# EAGLE design CAT-control-V1 (EAGLE 9.2.2)
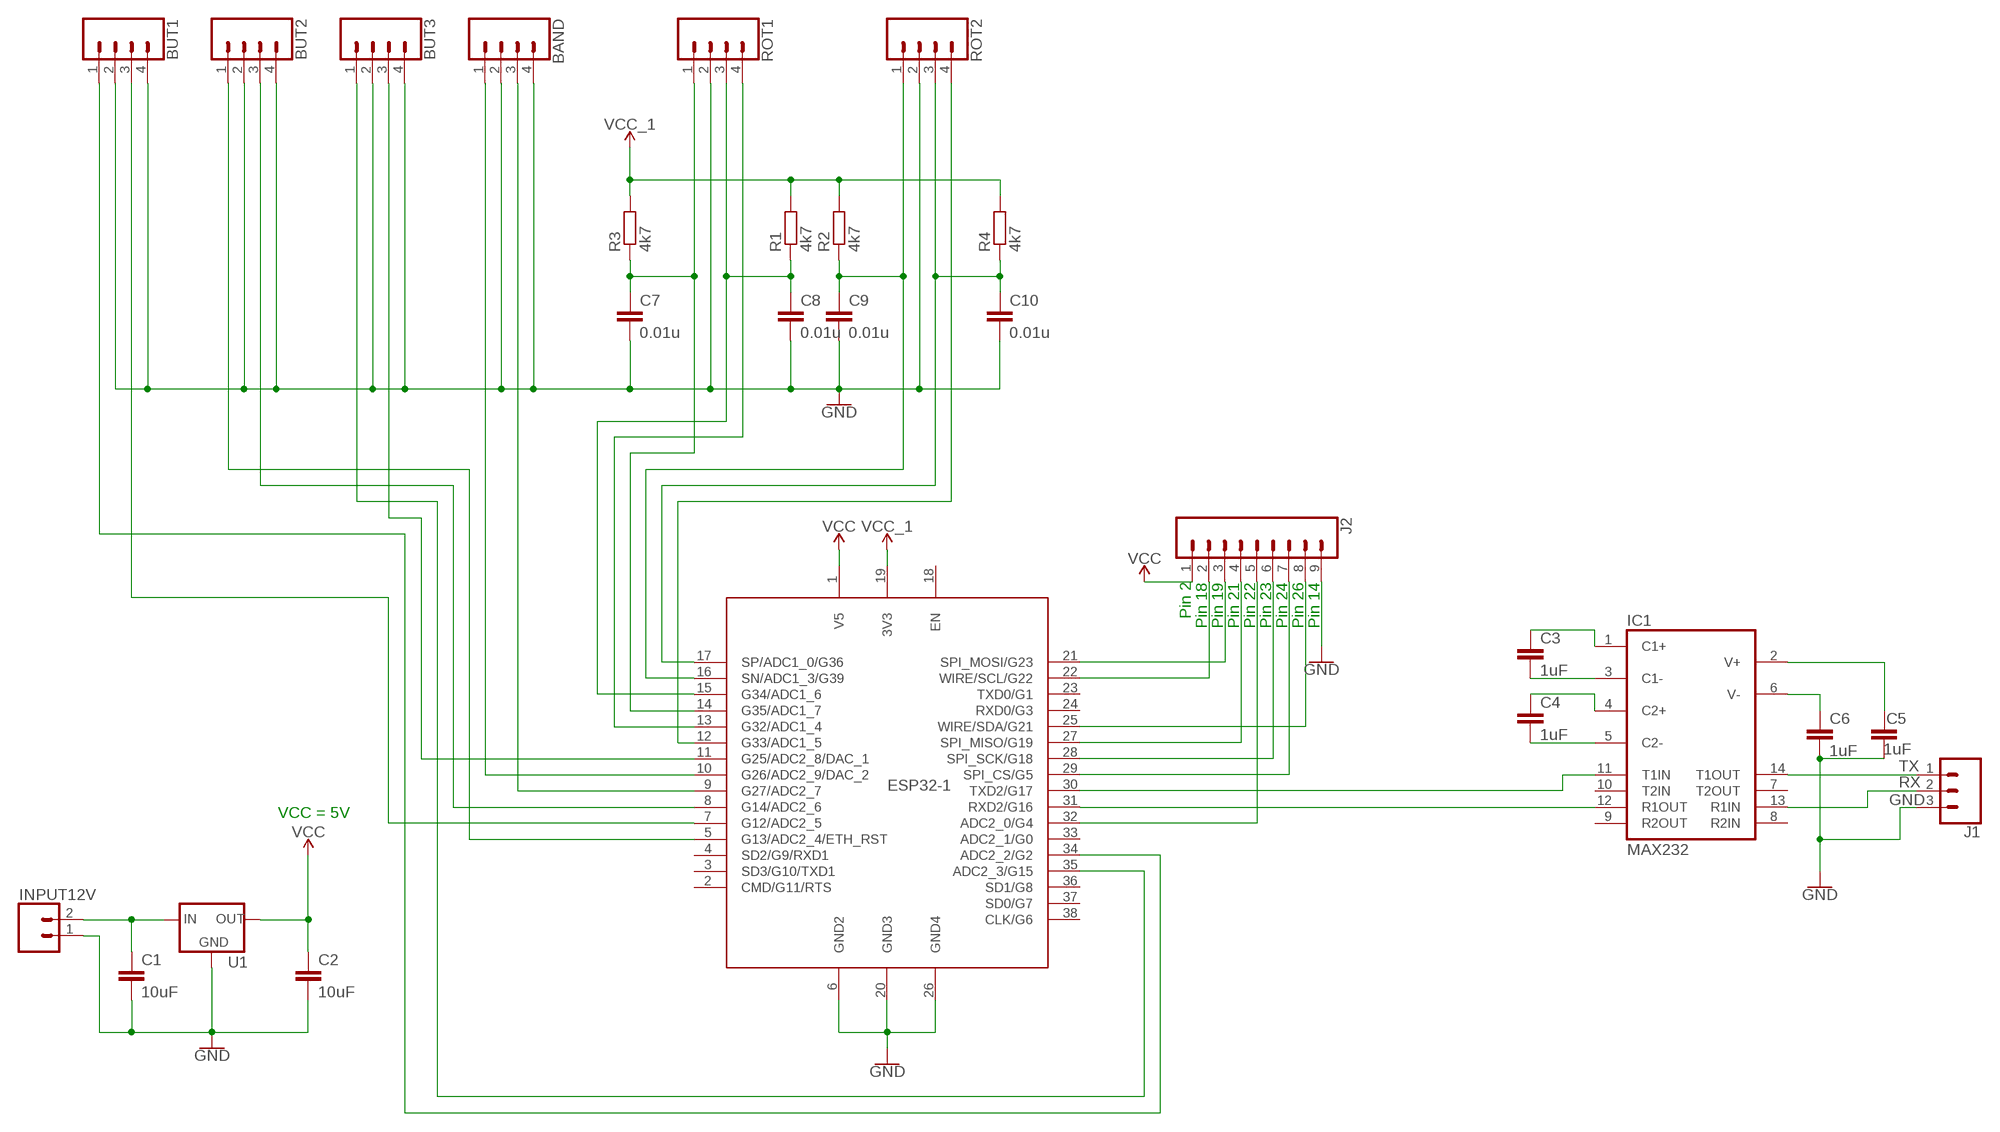
[diagram p0: schematic, sheet 1]

## Parts
BAND  CONN_04POLAR  [MOLEX-1X4]
BUT1  CONN_04POLAR  [MOLEX-1X4]
BUT2  CONN_04POLAR  [MOLEX-1X4]
BUT3  CONN_04POLAR  [MOLEX-1X4]
C1  10uF  CAPACITORS-EUC1206  [C1206]
C2  10uF  CAPACITORS-EUC1206  [C1206]
C3  1uF  CAPACITORS-EUC1206  [C1206]
C4  1uF  CAPACITORS-EUC1206  [C1206]
C5  1uF  CAPACITORS-EUC1206  [C1206]
C6  1uF  CAPACITORS-EUC1206  [C1206]
C7  0.01u  CAPACITORS-EU025-024X044  [C025-024X044]
C8  0.01u  CAPACITORS-EU025-024X044  [C025-024X044]
C9  0.01u  CAPACITORS-EU025-024X044  [C025-024X044]
C10  0.01u  CAPACITORS-EU025-024X044  [C025-024X044]
ESP32-1  NODEMCU_ESP32_WROOM_32  [NODEMCU_ESP32_WROOM_32--38PINS]
IC1  MAX232  [DIL16]
INPUT12V  CONN_025MM  [SCREWTERMINAL-5MM-2]
J1  CONN_03SCREW  [SCREWTERMINAL-3.5MM-3]
J2  CONN_09  [1X09]
R1  4k7  RESISTORS-EUR1206  [R1206]
R2  4k7  RESISTORS-EUR1206  [R1206]
R3  4k7  RESISTORS-EUR1206  [R1206]
R4  4k7  RESISTORS-EUR1206  [R1206]
ROT1  CONN_04POLAR  [MOLEX-1X4]
ROT2  CONN_04POLAR  [MOLEX-1X4]
U1  V_REG_78XXSINK  [TO220-IGO]

## Nets
GND: BAND.2 BAND.4 BUT1.2 BUT1.4 BUT2.2 BUT2.4 BUT3.2 BUT3.4 C1.2 C2.2 C5.1 C6.2 C7.2 C8.2 C9.2 C10.2 ESP32-1.6(GND2) ESP32-1.20(GND3) ESP32-1.26(GND4) INPUT12V.1 J1.3 J2.9 ROT1.2 ROT2.2 U1.GND
N$1: C1.1 INPUT12V.2 U1.IN
N$2: C3.1 IC1.1(C1+)
N$3: C3.2 IC1.3(C1-)
N$4: C4.1 IC1.4(C2+)
N$5: C4.2 IC1.5(C2-)
N$6: C8.1 ESP32-1.15(G34/ADC1_6) R1.1 ROT1.3
N$7: C6.1 IC1.6(V-)
N$8: C5.2 IC1.2(V+)
N$9: ESP32-1.31(RXD2/G16) IC1.12(R1OUT)
N$10: ESP32-1.22(WIRE/SCL/G22) J2.2
N$11: ESP32-1.21(SPI_MOSI/G23) J2.3
N$12: ESP32-1.32(ADC2_0/G4) J2.5
N$13: ESP32-1.27(SPI_MISO/G19) J2.4
N$14: ESP32-1.29(SPI_CS/G5) J2.7
N$15: ESP32-1.28(SPI_SCK/G18) J2.6
N$16: ESP32-1.25(WIRE/SDA/G21) J2.8
N$17: ESP32-1.13(G32/ADC1_4) ROT1.4
N$18: C10.1 ESP32-1.17(SP/ADC1_0/G36) R4.1 ROT2.3
N$19: C9.1 ESP32-1.16(SN/ADC1_3/G39) R2.1 ROT2.1
N$20: ESP32-1.30(TXD2/G17) IC1.11(T1IN)
N$21: BAND.1 ESP32-1.10(G26/ADC2_9/DAC_2)
N$22: ESP32-1.12(G33/ADC1_5) ROT2.4
N$23: C7.1 ESP32-1.14(G35/ADC1_7) R3.1 ROT1.1
N$24: BAND.3 ESP32-1.9(G27/ADC2_7)
N$25: BUT2.1 ESP32-1.5(G13/ADC2_4/ETH_RST)
N$26: BUT1.3 ESP32-1.7(G12/ADC2_5)
N$27: BUT3.1 ESP32-1.35(ADC2_3/G15)
N$28: BUT3.3 ESP32-1.11(G25/ADC2_8/DAC_1)
N$29: BUT1.1 ESP32-1.34(ADC2_2/G2)
N$31: BUT2.3 ESP32-1.8(G14/ADC2_6)
RX: IC1.13(R1IN) J1.2
TX: IC1.14(T1OUT) J1.1
VCC: C2.1 ESP32-1.1(V5) J2.1 U1.OUT
VCC_1: ESP32-1.19(3V3) R1.2 R2.2 R3.2 R4.2
Unconnected: ESP32-1.3(SD3/G10/TXD1) ESP32-1.4(SD2/G9/RXD1) ESP32-1.18(EN) ESP32-1.23(TXD0/G1) ESP32-1.24(RXD0/G3) ESP32-1.33(ADC2_1/G0) ESP32-1.36(SD1/G8) ESP32-1.37(SD0/G7) ESP32-1.38(CLK/G6) IC1.7(T2OUT) IC1.8(R2IN) IC1.9(R2OUT) IC1.10(T2IN)

## Notes on the sheet
- Pin 2
- Pin 18 | Pin 19 | Pin 21 | Pin 22 | Pin 23 | Pin 24 | Pin 26 | Pin 14
- VCC = 5V

## Power pins joined to a net without a drawn wire
CMD/G11/RTS: ESP32-1.2(CMD/G11/RTS)
GND: IC1.15(GND)
VCC: IC1.16(VCC)

## Library data of the parts
BAND BUT1-BUT3 ROT1 ROT2 = Matejevi_elementi:CONN_04: Multi connection point. Often used as Generic Header-pin footprint for 0.1 inch spaced/style header connections On any of the 0.1 inch spaced packages, you can populate with these: Break Away Headers - Straight <https://www.sparkfun.com/products/116> (PRT-00116) Break Away Male Headers - Right Angle <https://www.sparkfun.com/products/553> (PRT-00553) Female Headers <https://www.sparkfun.com/products/115> (PRT-00115) Break Away Headers - Machine Pin <https://www.sparkfun.com/products/117> (PRT-00117) Break Away Female Headers - Swiss Machine Pin <https://www.sparkfun.com/products/743> (PRT-00743) For SCREWTERMINALS and SPRING TERMINALS visit here: Screw Terimnals on SparkFun.com <https://www.sparkfun.com/search/results?term=Screw+Terminals> (5mm/3.5mm/2.54mm spacing) This device is also useful as a general connection point to wire up your design to another part of your project. Our various solder wires solder well into these plated through hole pads. Hook-Up Wire - Assortment (Stranded, 22 AWG) <https://www.sparkfun.com/products/11375> (PRT-11375) Hook-Up Wire - Assortment (Solid Core, 22 AWG) <https://www.sparkfun.com/products/11367> (PRT-11367) View the entire wire category on our website here <https://www.sparkfun.com/categories/141> Special notes: Molex polarized connector foot print use with SKU : PRT-08231 with associated crimp pins and housings. 1MM SMD Version SKU: PRT-10208; PROD_ID: CONN-08186; SF_ID: PRT-08231
C1-C10 = Matejevi_elementi:CAPACITORS-EU: CAPACITOR, European symbol; SPICEPREFIX: C
ESP32-1 = ESP32_NODEMCU_WROOM_32:NODEMCU_ESP32_WROOM_32: NODEMCU ESP32 WROOM 32 38 Pins PINOUT: https://cdn.shopify.com/s/files/1/1509/1638/files/ESP_-_32_NodeMCU_Developmentboard_Pinout_Diagram.jpg?4479111012146266271; ESP: ESP32 WROOM 32
IC1 = maxim:MAX232: RS232 TRANSCEIVER; MF: MAXIM; MPN: MAX232ACPE+; OC_FARNELL: 9723773; OC_NEWARK: 68K4544
INPUT12V = Matejevi_elementi:CONN_02: Multi connection point. Often used as Generic Header-pin footprint for 0.1 inch spaced/style header connections On any of the 0.1 inch spaced packages, you can populate with these: Break Away Headers - Straight <https://www.sparkfun.com/products/116> (PRT-00116) Break Away Male Headers - Right Angle <https://www.sparkfun.com/products/553> (PRT-00553) Female Headers <https://www.sparkfun.com/products/115> (PRT-00115) Break Away Headers - Machine Pin <https://www.sparkfun.com/products/117> (PRT-00117) Break Away Female Headers - Swiss Machine Pin <https://www.sparkfun.com/products/743> (PRT-00743) For SCREWTERMINALS and SPRING TERMINALS visit here: Screw Terimnals on SparkFun.com <https://www.sparkfun.com/search/results?term=Screw+Terminals> (5mm/3.5mm/2.54mm spacing) This device is also useful as a general connection point to wire up your design to another part of your project. Our various solder wires solder well into these plated through hole pads. Hook-Up Wire - Assortment (Stranded, 22 AWG) <https://www.sparkfun.com/products/11375> (PRT-11375) Hook-Up Wire - Assortment (Solid Core, 22 AWG) <https://www.sparkfun.com/products/11367> (PRT-11367) View the entire wire category on our website here <https://www.sparkfun.com/categories/141> Special notes: Molex polarized connector foot print use with: PRT-08233 with associated crimp pins and housings. 2.54_SCREWTERM for use with PRT-10571. 3.5mm Screw Terminal footprints for PRT-08084 5mm Screw Terminal footprints for use with PRT-08432; SF_SKU: PRT-08432
J1 = Matejevi_elementi:CONN_03: Multi connection point. Often used as Generic Header-pin footprint for 0.1 inch spaced/style header connections On any of the 0.1 inch spaced packages, you can populate with these: Break Away Headers - Straight <https://www.sparkfun.com/products/116> (PRT-00116) Break Away Male Headers - Right Angle <https://www.sparkfun.com/products/553> (PRT-00553) Female Headers <https://www.sparkfun.com/products/115> (PRT-00115) Break Away Headers - Machine Pin <https://www.sparkfun.com/products/117> (PRT-00117) Break Away Female Headers - Swiss Machine Pin <https://www.sparkfun.com/products/743> (PRT-00743) Stackable Header - 3 Pin (Female, 0.1") <https://www.sparkfun.com/products/13875> (PRT-13875) For SCREWTERMINALS and SPRING TERMINALS visit here: Screw Terimnals on SparkFun.com <https://www.sparkfun.com/search/results?term=Screw+Terminals> (5mm/3.5mm/2.54mm spacing) This device is also useful as a general connection point to wire up your design to another part of your project. Our various solder wires solder well into these plated through hole pads. Hook-Up Wire - Assortment (Stranded, 22 AWG) <https://www.sparkfun.com/products/11375> (PRT-11375) Hook-Up Wire - Assortment (Solid Core, 22 AWG) <https://www.sparkfun.com/products/11367> (PRT-11367) View the entire wire category on our website here <https://www.sparkfun.com/categories/141> Special notes: Molex polarized connector foot print use with SKU : PRT-08232 with associated crimp pins and housings.; PROD_ID: CONN-08288; SF_ID: PRT-08235
J2 = SparkFun-Connectors:CONN_09: Multi connection point. Often used as Generic Header-pin footprint for 0.1 inch spaced/style header connections On any of the 0.1 inch spaced packages, you can populate with these: Break Away Headers - Straight <https://www.sparkfun.com/products/116> (PRT-00116) Break Away Male Headers - Right Angle <https://www.sparkfun.com/products/553> (PRT-00553) Female Headers <https://www.sparkfun.com/products/115> (PRT-00115) Break Away Headers - Machine Pin <https://www.sparkfun.com/products/117> (PRT-00117) Break Away Female Headers - Swiss Machine Pin <https://www.sparkfun.com/products/743> (PRT-00743) For SCREWTERMINALS and SPRING TERMINALS visit here: Screw Terimnals on SparkFun.com <https://www.sparkfun.com/search/results?term=Screw+Terminals> (5mm/3.5mm/2.54mm spacing) This device is also useful as a general connection point to wire up your design to another part of your project. Our various solder wires solder well into these plated through hole pads. Hook-Up Wire - Assortment (Stranded, 22 AWG) <https://www.sparkfun.com/products/11375> (PRT-11375) Hook-Up Wire - Assortment (Solid Core, 22 AWG) <https://www.sparkfun.com/products/11367> (PRT-11367) View the entire wire category on our website here <https://www.sparkfun.com/categories/141> Special notes: Molex polarized connector foot print use with SKU : PRT-08231 with associated crimp pins and housings. 1MM SMD Version SKU: PRT-10208 NOTES ON THE VARIANTS LOCK and LOCK_LONGPADS... This footprint was designed to help hold the alignment of a through-hole component (i.e. 6-pin header) while soldering it into place. You may notice that each hole has been shifted either up or down by 0.005 of an inch from it's more standard position (which is a perfectly straight line). This slight alteration caused the pins (the squares in the middle) to touch the edges of the holes. Because they are alternating, it causes a "brace" to hold the component in place. 0.005 has proven to be the perfect amount of "off-center" position when using our standard breakaway headers. Although looks a little odd when you look at the bare footprint, once you have a header in there, the alteration is very hard to notice. Also,if you push a header all the way into place, it is covered up entirely on the bottom side.
R1-R4 = Matejevi_elementi:RESISTORS-EU: RESISTOR, European symbol; SPICEPREFIX: R
U1 = Matejevi_elementi:V_REG_78XX: Voltage Regulator Standard 78xx regulator. IGO (Input Ground Output). Spark Fun Electronics SKU : COM-00107

## Board
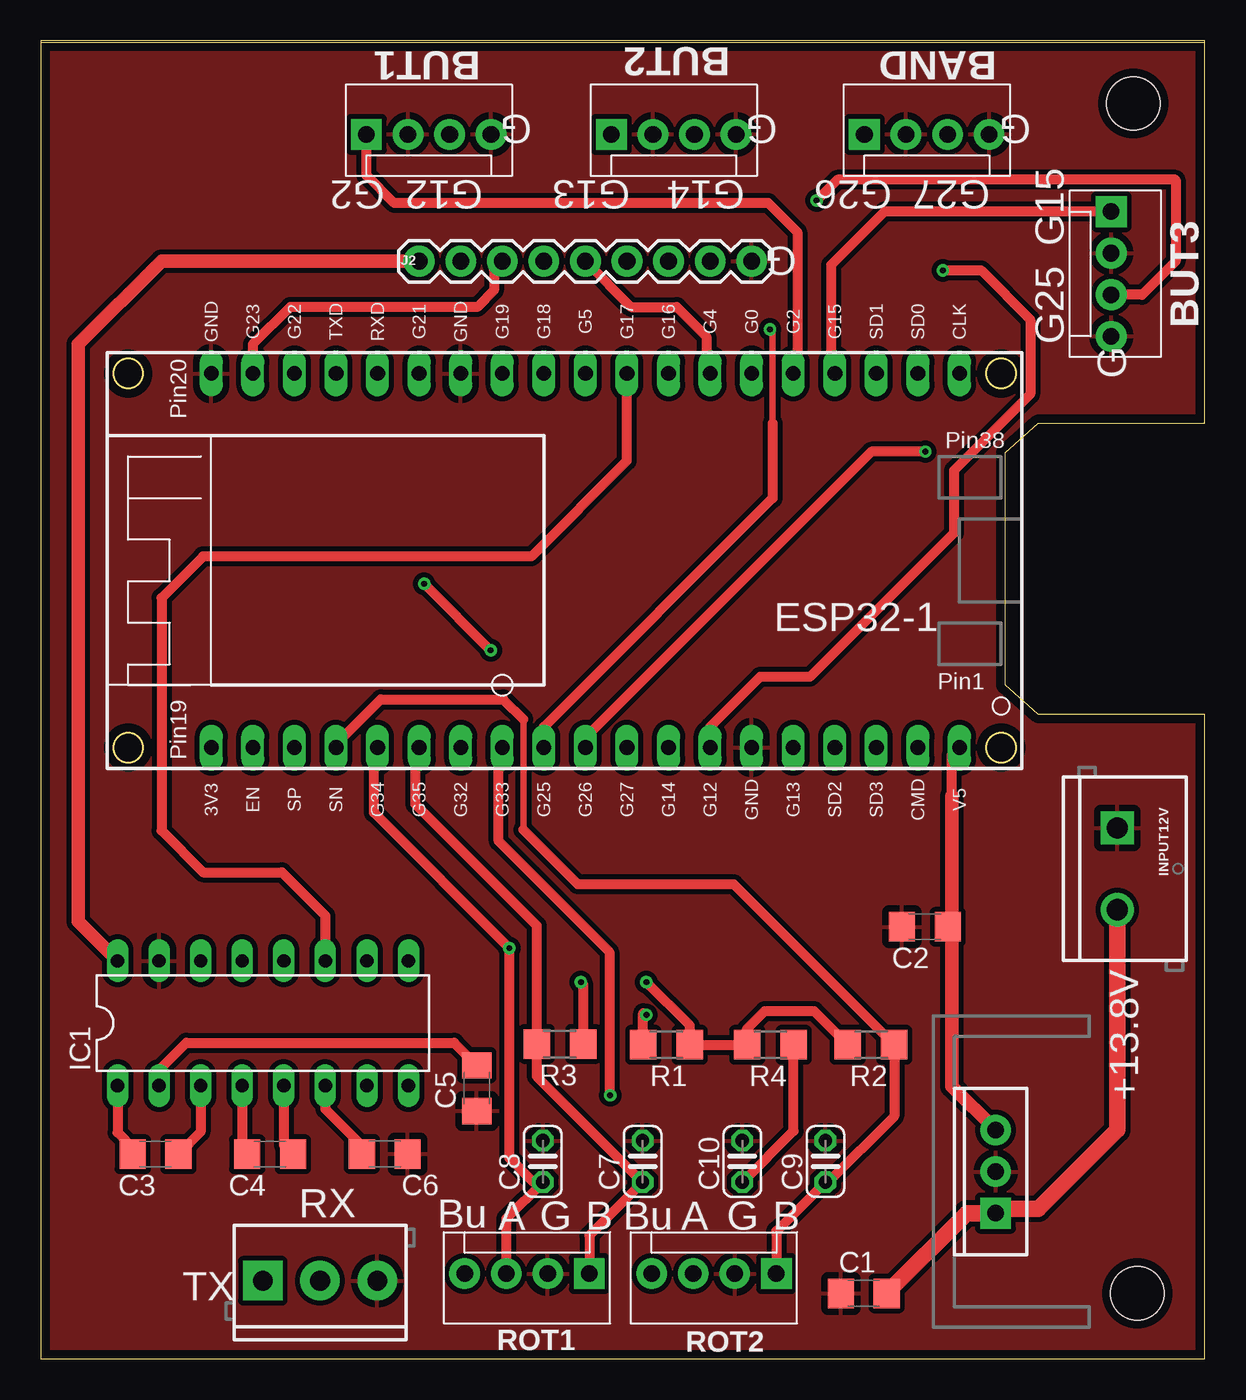
[diagram p1: board, top side]
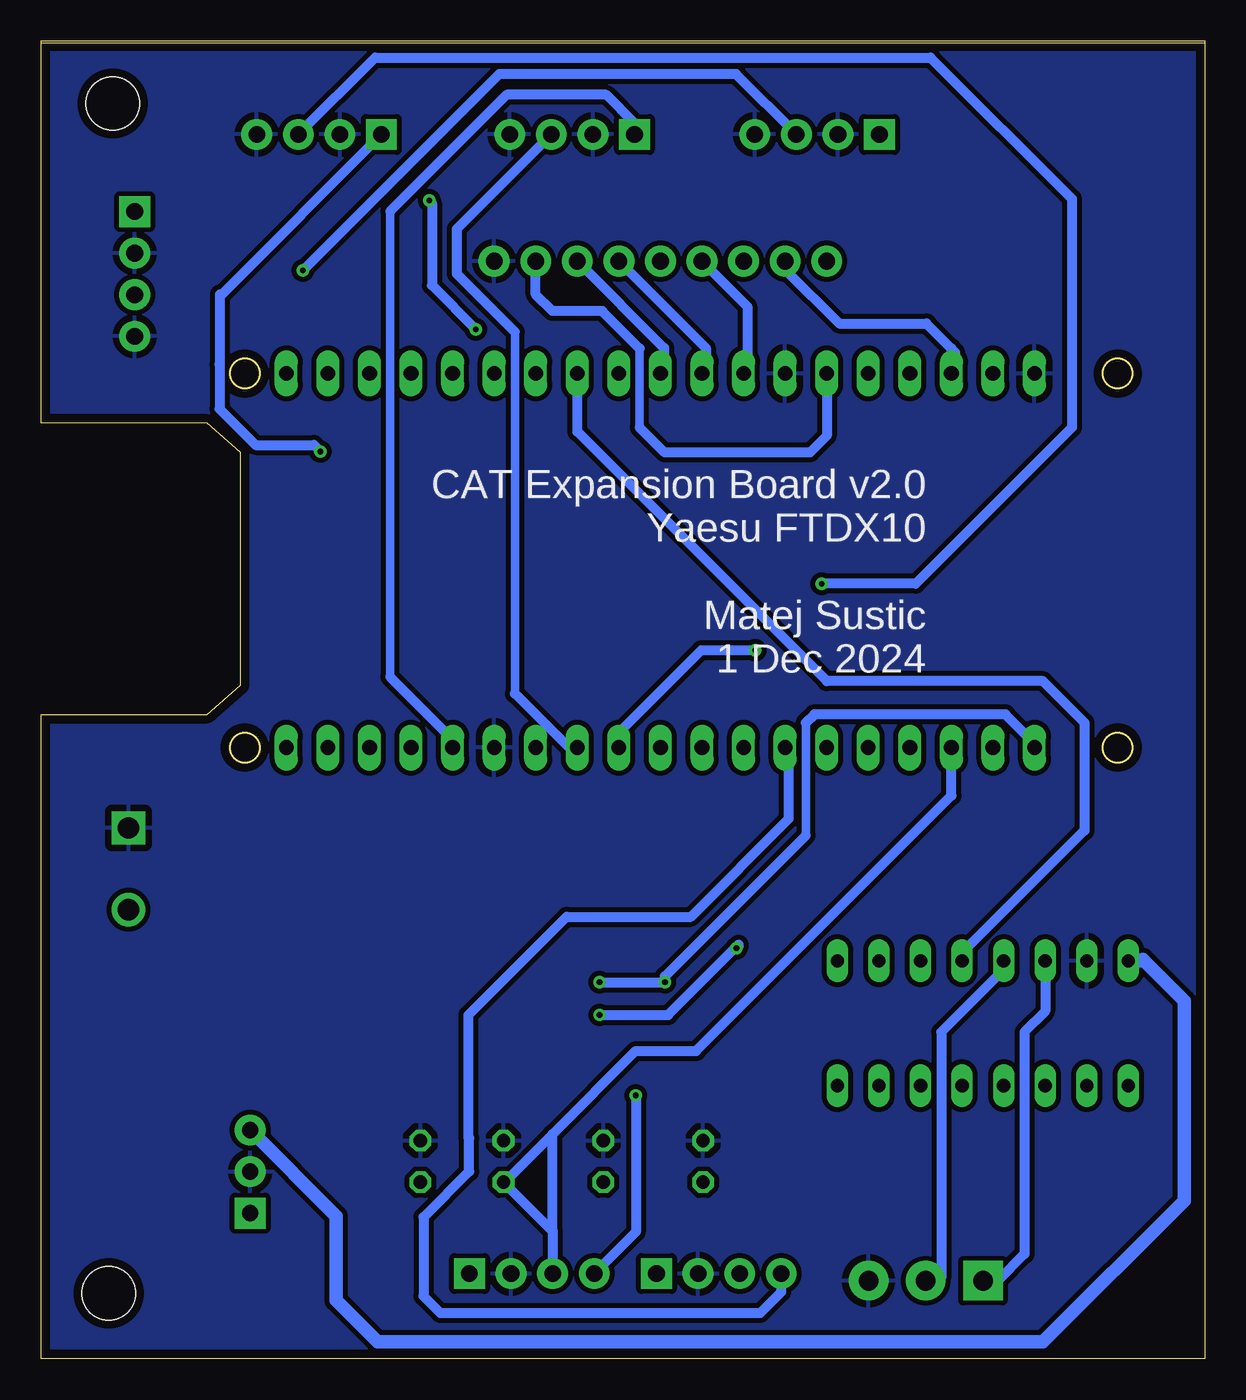
[diagram p2: board, bottom side, seen from below]

Size 71.13 x 80.52 mm. Coordinates in mm from the lower left corner, seen from the top.
Outline: 0,0 71.11,0
Outline: 71.13,80.39 0,80.39 0,0
Outline: 0,0 71.12,0 71.12,39.37 60.96,39.37 58.93,41.15 58.93,55.37 60.96,57.15 71.12,57.15 71.12,80.52 0,80.52 0,0
Copper layers (1*16): Top 0.035mm / dielectric 1.5mm / Bottom 0.035mm
Design rules "default *": minimum track width 16mil, minimum drill 0.35mm, track to track 12mil, track to pad 12mil, pad to pad 12mil, via to via 12mil, smd to smd 12mil, copper to edge 20mil, drill to drill 10mil, minimum pad ring 10mil, minimum via ring 8mil, stop-mask expansion 4mil, vias tented up to drill 0mil, thermal gap 16mil
Holes 3.25 mm at 66.75,76.7 67,4

### Footprints (pad centres in the part's own frame; a part is rotated, then mirrored left to right if it is on the bottom)
MOLEX-1X4 = drill 1.016 pad 1.88 square: 1 0,0 | drill 1.016 pad 1.88: 2 2.54,0; 3 5.08,0; 4 7.62,0
C1206 = smd 1.6 x 1.8: 1 -1.4,0; 2 1.4,0
C025-024X044 = drill 0.813 octagon: 1 -1.27,0; 2 1.27,0
NODEMCU_ESP32_WROOM_32--38PINS = drill 0.9 long: 1 -11.43,-27.94; 2 -11.43,-25.4; 3 -11.43,-22.86; 4 -11.43,-20.32; 5 -11.43,-17.78; 6 -11.43,-15.24; 7 -11.43,-12.7; 8 -11.43,-10.16; 9 -11.43,-7.62; 10 -11.43,-5.08; 11 -11.43,-2.54; 12 -11.43,0; 13 -11.43,2.54; 14 -11.43,5.08; 15 -11.43,7.62; 16 -11.43,10.16; 17 -11.43,12.7; 18 -11.43,15.24; 19 -11.43,17.78; 20 11.43,17.78; 21 11.43,15.24; 22 11.43,12.7; 23 11.43,10.16; 24 11.43,7.62; 25 11.43,5.08; 26 11.43,2.54; 27 11.43,0; 28 11.43,-2.54; 29 11.43,-5.08; 30 11.43,-7.62; 31 11.43,-10.16; 32 11.43,-12.7; 33 11.43,-15.24; 34 11.43,-17.78; 35 11.43,-20.32; 36 11.43,-22.86; 37 11.43,-25.4; 38 11.43,-27.94
DIL16 = drill 0.813 long: 1 -8.89,-3.81; 2 -6.35,-3.81; 3 -3.81,-3.81; 4 -1.27,-3.81; 5 1.27,-3.81; 6 3.81,-3.81; 7 6.35,-3.81; 8 8.89,-3.81; 9 8.89,3.81; 10 6.35,3.81; 11 3.81,3.81; 12 1.27,3.81; 13 -1.27,3.81; 14 -3.81,3.81; 15 -6.35,3.81; 16 -8.89,3.81
SCREWTERMINAL-5MM-2 = drill 1.3 pad 2.032 square: 1 0,0 | drill 1.3 pad 2.032: 2 5,0
SCREWTERMINAL-3.5MM-3 = drill 1.2 pad 2.413 square: 1 0,0 | drill 1.2 pad 2.413: 2 3.5,0; 3 7,0
1X09 = drill 1.016 pad 1.88: 1 0,0; 2 2.54,0; 3 5.08,0; 4 7.62,0; 5 10.16,0; 6 12.7,0; 7 15.24,0; 8 17.78,0; 9 20.32,0
R1206 = smd 1.6 x 1.803: 1 -1.422,0; 2 1.422,0
TO220-IGO = drill 1 pad 1.88: GND 0,0; OUT 2.54,0 | drill 1 pad 1.88 square: IN -2.54,0

### Placement (x,y rotation side)
BAND  50.32,74.8 0 top
BUT1  19.89,74.8 0 top
BUT2  34.86,74.8 0 top
BUT3  65.41,70.09 270 top
C1  50.28,3.98 180 top
C2  54.02,26.39 180 top
C3  7,12.49 0 top
C4  14.01,12.49 0 top
C5  26.64,16.53 90 top
C6  21.02,12.5 0 top
C7  36.77,12.05 90 top
C8  30.67,12.05 90 top
C9  47.94,12.05 90 top
C10  42.86,12.05 90 top
ESP32-1  28.19,48.77 90 top
IC1  13.57,20.5 0 top
INPUT12V  65.78,32.43 270 top
J1  13.56,4.75 0 top
J2  23.11,67.06 0 top
R1  38.23,19.18 0 top
R2  50.72,19.18 180 top
R3  31.72,19.22 0 top
R4  44.58,19.18 180 top
ROT1  33.51,5.19 180 top
ROT2  44.94,5.19 180 top
U1  58.34,11.43 90 top

### Tracks (layer width: path | path; a pad name or v marks a point on that pad's centre or on a via)
GND
  pour Top: -13.97,103.59 -13.97,-1.27 149.88,-1.27 149.88,103.59
  pour Bottom: -14.24,105.5 -14.24,-2.54 151.66,-2.54 151.66,105.5
N$1
  Top 1.016: INPUT12V.2 65.78,13.96 60.96,9.14 58.6,9.14 U1.IN 56.58,8.88 C1.1
N$2
  Top 0.406: 5.69,12.8 C3.1
  Top 0.61: IC1.1 4.68,13.81 5.69,12.8
N$3
  Top 0.406: 8.53,12.8 C3.2
  Top 0.61: IC1.3 9.76,13.85 C3.2
N$4
  Top 0.61: IC1.4 12.3,12.79 C4.1
N$5
  Top 0.61: IC1.5 14.84,13.05 C4.2
N$6  (via drill 0.35)
  Top 0.406: 36.63,19.2 R1.1
  Top 0.61: ROT1.3 28.43,8.54 C8.1 30.11,10.78 28.63,12.26 v28.63,25.07 20.35,33.36 20.35,37.11 ESP32-1.15 | R1.1 36.8,21.09 | 36.8,21.09 36.8,21.1 | 36.8,21.09 36.9,21 v37,21
  Bottom 0.61: v37,21 32.8,21 28.5,25.3 28.5,25.2 v28.63,25.07
N$7
  Top 0.61: IC1.6 17.38,15.25 19.62,13.01 C6.1
N$8
  Top 0.61: IC1.2 7.22,17.64 8.89,19.3 25.26,19.3 C5.2
N$9
  Bottom 0.61: IC1.12 14.84,24.78 7.37,32.26 7.37,38.86 9.91,41.4 23.11,41.4 38.35,56.64 ESP32-1.31
N$10
  Bottom 0.61: J2.2 25.65,66.55 22.35,63.25 17.02,63.25 15.49,61.72 | 15.49,61.72 15.27,61.49 | 15.49,61.72 ESP32-1.22
N$11
  Top 0.406: ESP32-1.21 13.16,60.45 12.95,60.45
  Top 0.61: J2.3 27.69,66.55 27.69,65.28 26.67,64.26 15.24,64.26 12.95,61.98 12.95,60.45 12.95,60.25
N$12
  Top 0.61: J2.5 36.07,64.26 38.86,64.26 40.67,62.46 40.67,60.42 ESP32-1.32
N$13
  Bottom 0.61: J2.4 27.97,64.29 27.97,60.42 ESP32-1.27
N$14
  Bottom 0.61: J2.7 33.05,61.75 33.05,60.42 ESP32-1.29
N$15
  Bottom 0.61: J2.6 30.51,61.75 30.51,60.42 ESP32-1.28
N$16
  Bottom 0.508: 34.54,56.9 34.54,61.72
  Bottom 0.61: 40.89,66.85 J2.8 40.89,65.02 39.88,64.01 36.83,64.01 34.54,61.72 | 34.54,61.72 | 34.54,56.9 33.02,55.37 24.13,55.37 23.11,56.39 ESP32-1.25
N$17
  Bottom 0.61: ROT1.4 25.89,4.08 27.18,2.79 46.74,2.79 47.75,3.81 47.75,8.64 44.96,11.43 44.96,13.46 45,13.5 45,21 39,27 31.42,27 25.43,32.99 25.43,37.11 ESP32-1.13
N$18
  Top 0.61: C10.1 46,13.91 R4.1
  Bottom 0.61: 39.86,7.78 C10.1 42.81,10.78 39.88,13.72 | 39.86,7.78 ROT2.3 | 39.88,13.72 34.8,18.8 31.1,18.8 15.49,34.4 ESP32-1.17 | 39.86,7.78 39.86,13.7 39.88,13.72
N$19
  Top 0.406: 48.01,10.57 48.01,10.67 | 48.01,10.67 48.01,10.92 | 48.01,10.67 C9.1 | 29.48,39.05 29.48,32.31 | ESP32-1.16 18.14,37.34 18.06,37.59
  Top 0.61: C9.1 44.94,7.78 ROT2.1 | 29.48,39.05 28.25,40.29 20.76,40.29 18.06,37.59 | 29.48,32.31 32.8,29 42.32,29 R2.1 52.15,14.81 48.01,10.67
N$20
  Top 0.61: IC1.11 17.38,27.07 14.73,29.72 9.91,29.72 7.37,32.26 7.37,46.48 9.91,49.02 29.97,49.02 35.81,54.86 ESP32-1.30
N$21  (via drill 0.35)
  Top 0.406: ESP32-1.10 33.43,37.34 33.43,37.69 33.22,37.9
  Top 0.61: v54.05,55.42 50.75,55.42 33.22,37.9 33.05,37.72
  Bottom 0.61: BAND.1 60.1,65.02 60.2,65.02 60.2,60.78 60.22,60.76 60.22,58.02 58.02,55.82 54.45,55.82 v54.05,55.42
N$22  (via drill 0.35)
  Top 0.61: v34.78,16.09 34.75,16.12 34.75,24.85 27.97,31.63 27.97,37.11 ESP32-1.12
  Bottom 0.61: v34.78,16.09 34.78,7.73 ROT2.4
N$23
  Top 0.61: ROT1.1 33.51,7.53 C7.1 30.3,17.25 R3.1 30.3,26.45 22.89,33.87 22.89,37.11 ESP32-1.14
N$24  (via drill 0.35)
  Top 0.61: v23.42,47.35 v27.48,43.28
  Bottom 0.61: 35.84,38.23 35.81,38.25 | 35.81,38.25 30.79,43.28 v27.48,43.28 | BAND.3 50.7,79.5 16.76,79.5 8.13,70.87 8.13,56.9 17.68,47.35 v23.42,47.35 | ESP32-1.9 35.81,38.25
N$25
  Bottom 0.508: 49.78,70.1 49.78,41.66
  Bottom 0.61: BUT2.1 34.86,75.5 36.58,77.22 42.67,77.22 49.78,70.1 | 49.78,41.66 45.97,37.85 ESP32-1.5
N$26  (via drill 0.35)
  Top 0.61: v55.12,66.5 57.45,66.5 60.45,63.5 60.45,58.93 55.79,54.27 55.79,50.46 46.99,41.66 43.94,41.66 40.89,38.61 ESP32-1.7
  Bottom 0.61: BUT1.3 28.65,78.49 43.13,78.49 v55.12,66.5
N$27
  Top 0.61: BUT3.1 51.55,70.09 48.29,66.83 48.29,60.42 ESP32-1.35
N$28  (via drill 0.35)
  Top 0.406: v44.55,62.89 44.7,62.74 44.7,57.15
  Top 0.61: v47.4,70.76 48.67,72.03 69.34,72.03 69.34,67.06 67.3,65.01 BUT3.3 | 44.7,57.15 44.7,52.58 30.73,38.61 ESP32-1.11
  Bottom 0.61: v47.4,70.76 47.24,70.61 47.24,65.58 v44.55,62.89
N$29
  Top 0.61: BUT1.1 19.89,72.31 21.59,70.61 44.45,70.61 46.23,68.83 46.23,60.45 ESP32-1.34
N$31
  Bottom 0.406: ESP32-1.8 38.76,37.34 38.81,37.29
  Bottom 0.508: 42.16,62.74 42.16,40.64
  Bottom 0.61: BUT2.3 45.72,69.02 45.72,66.29 42.16,62.74 | 42.16,40.64 38.81,37.29 38.13,36.6
RX
  Bottom 0.61: IC1.13 12.3,23.77 16.11,19.96 16.11,4.94 16.3,4.75 J1.2
TX
  Bottom 0.61: IC1.14 9.76,21.23 11.03,19.96 11.03,6.39 12.67,4.75 J1.1
VCC
  Top 0.406: 58.32,14 U1.OUT
  Top 0.61: 55.65,34.37 55.65,36.86 ESP32-1.1
  Top 0.813: 55.65,34.37 55.65,26.62 C2.1 55.67,26.13 55.67,16.64 U1.OUT | J2.1 7.37,67.06 2.29,61.98 2.29,26.7 IC1.16
  Bottom 0.813: U1.OUT 53.09,8.71 53.09,3.56 50.55,1.02 9.91,1.02 1.27,9.65 1.27,21.84 3.81,24.38 3.89,24.31 IC1.16
VCC_1  (via drill 0.35)
  Top 0.406: 39.83,18.85 R1.2 39.83,19.2 | 42.67,19.2 43.03,19.2 R4.2 42.67,19.2
  Top 0.61: 39.65,18.57 R1.2 | R1.2 R4.2 | R4.2 43.18,19.2 | R4.2 43.16,20.16 44.24,21.24 47.24,21.24 R2.2 | R1.2 39.65,20.35 v37,23 | v33,23 33.14,22.86 R3.2
  Bottom 0.508: 24.38,38.86 24.38,31.98
  Bottom 0.61: 24.38,38.86 23.88,39.37 12.19,39.37 10.41,37.59 ESP32-1.19 | v37,23 v33,23 33,23.36 24.38,31.98

### Text on the board
tPlace: +13.8V | RX | Bu | A | G | B | Bu | A | G | B | TX
tNames: G | G | G | G2 | G12 | G13 | G14 | G26 | G27 | G | G15 | G25 | G
bNames: CAT Expansion Board v2.0 / Yaesu FTDX10 / / Matej Sustic / 1 Dec 2024